# EasyEDA schematic SCH_clock1_2025-09-26.json
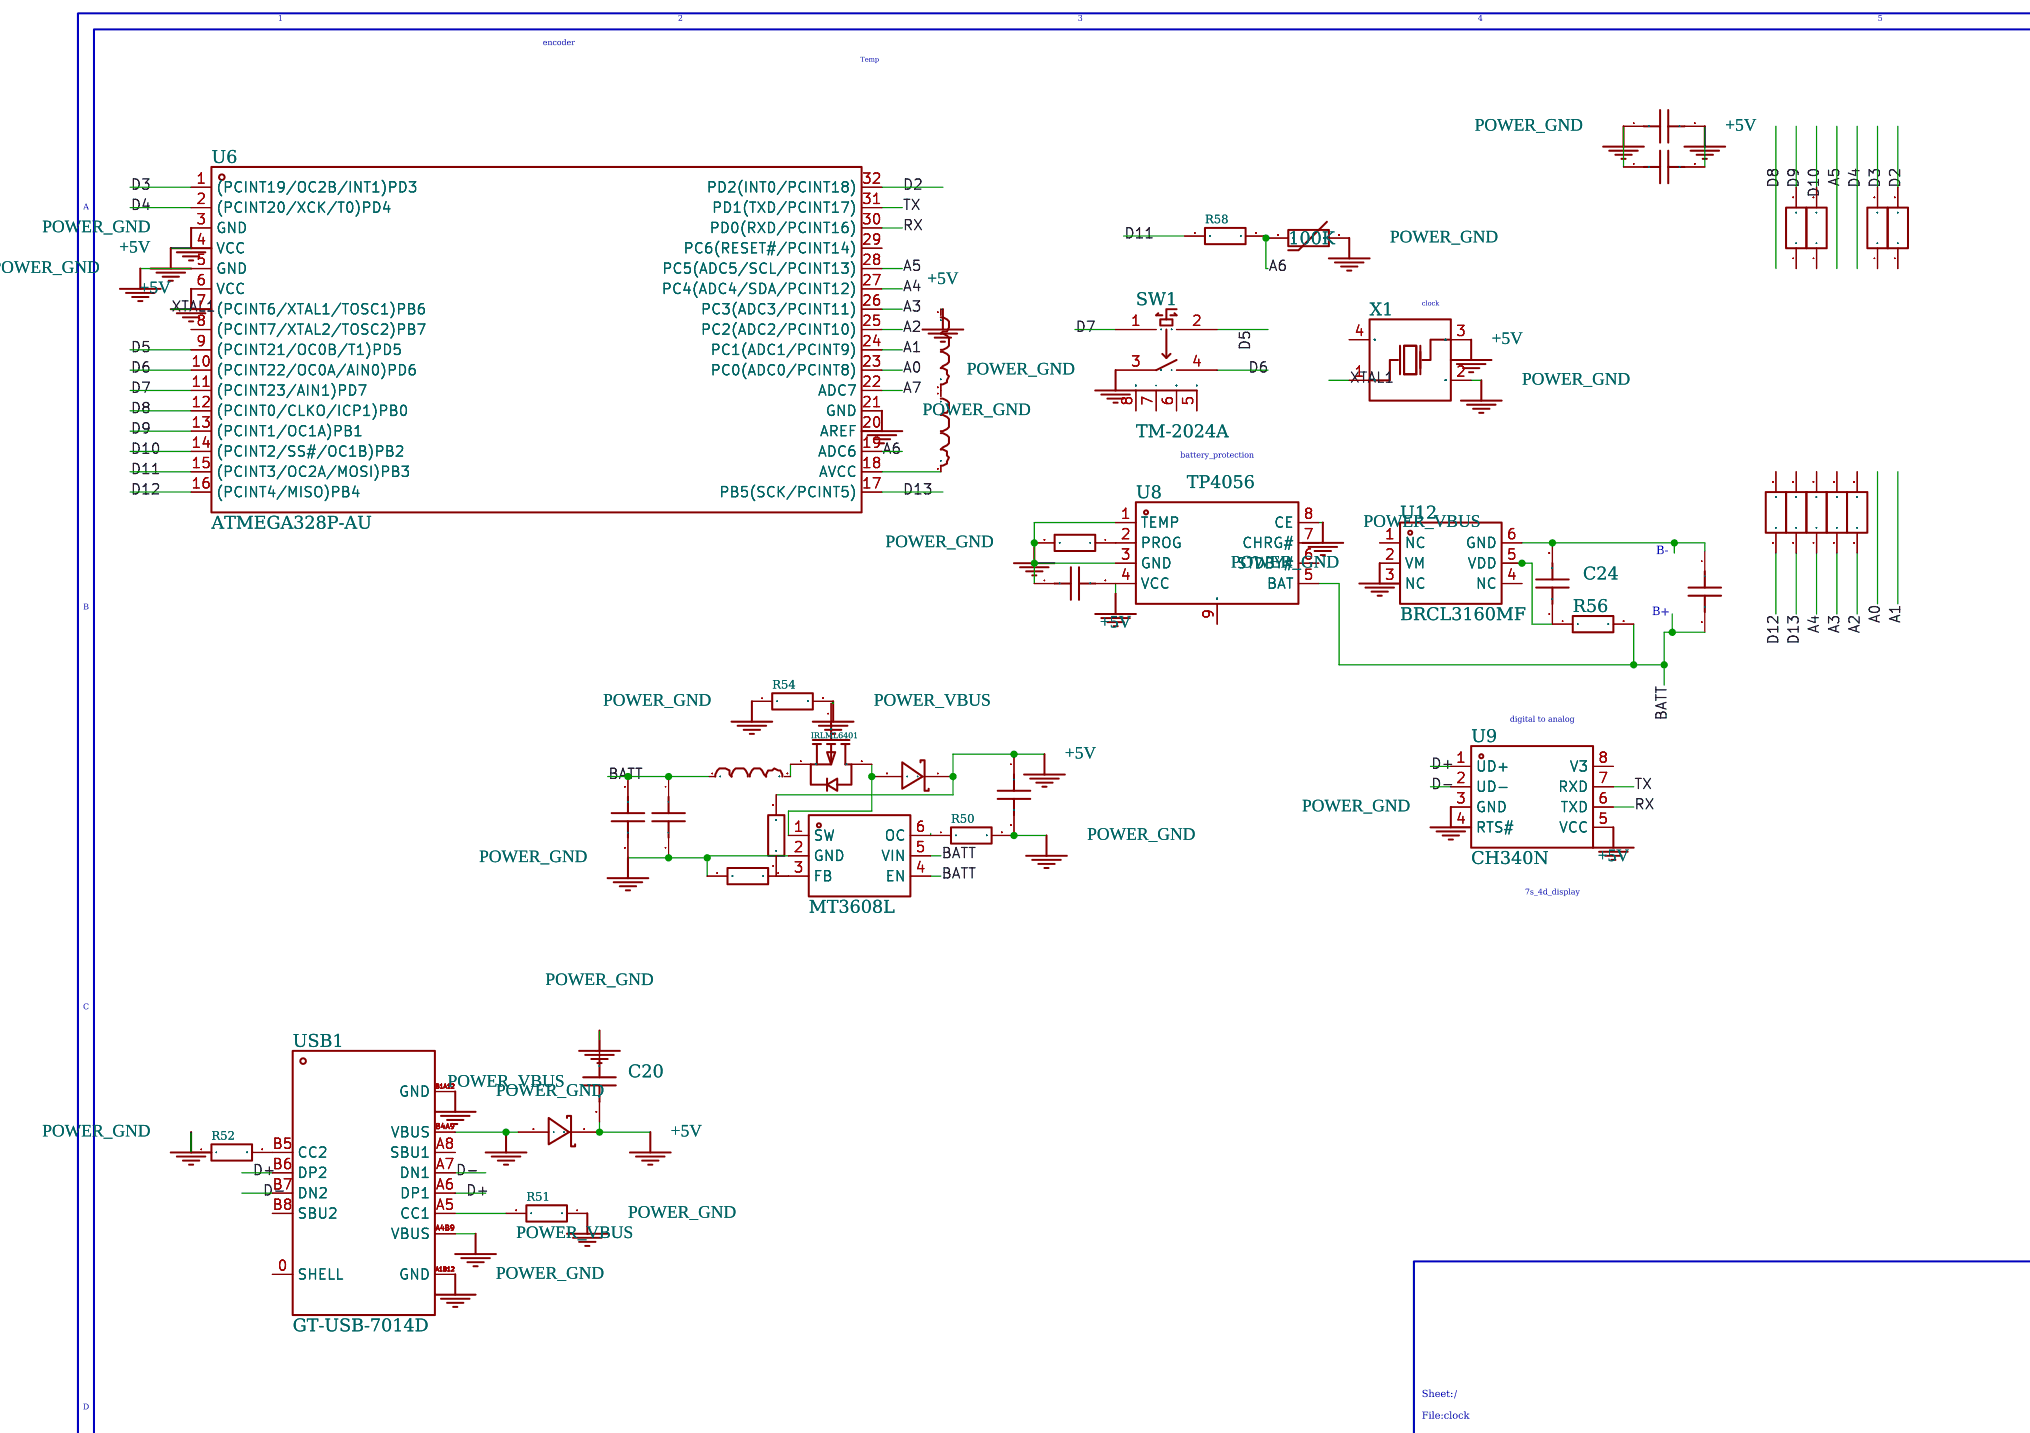
[diagram p0: schematic sheet]

## Parts
100K  NCP03WF104F05RL  [R0201]
C15  4.7uF  [C0402]
C16  4.7uF  [C0402]
C19  4.7uF  [C0402]
C20  4.7uF  [C0402]
C21  4.7uF  [C0402]
C24  100nF  [C0402]
C25  4.7uF  [C0402]
C27  4.7uF  [C0402]
C28  4.7uF  [C0402]
D5  DSK34  [SOD-123_L2.8-W1.8-LS3.7-RD]
D6  DSK34  [SOD-123_L2.8-W1.8-LS3.7-RD]
L3  4.7uH  [L1206]
L5  4.7uH  [L1206]
L6  4.7uH  [L1206]
Q1  IRLML6401  [SOT-23-3_L2.9-W1.3-P1.90-LS2.4-BR]
R39  1kΩ  [R0603]
R40  1kΩ  [R0603]
R41  1kΩ  [R0603]
R42  1kΩ  [R0603]
R43  1kΩ  [R0603]
R44  1kΩ  [R0603]
R45  1kΩ  [R0603]
R46  1kΩ  [R0603]
R48  2.4kΩ  [R0402]
R49  2.4kΩ  [R0402]
R50  100kΩ  [R0402]
R51  5.1kΩ  [R0402]
R52  5.1kΩ  [R0402]
R53  20kΩ  [R0402]
R54  5.1kΩ  [R0402]
R56  100Ω  [R0402]
R57  1kΩ  [R0603]
R58  100kΩ  [R0402]
SW1  TM-2024A  [SW-SMD_TM-2024A]
U6  ATMEGA328P-AU  [TQFP-32_L7.0-W7.0-P0.80-LS9.0-BL]
U8  TP4056  [ESOP-8_L4.9-W3.9-P1.27-LS6.0-BL-EP-1]
U9  CH340N  [SOP-8_L4.9-W3.9-P1.27-LS6.0-BL]
U10  MT3608L  [SOT-23-6_L2.9-W1.6-P0.95-LS2.8-BL_3]
U12  BRCL3160MF  [SOT-23-6_L2.9-W1.6-P0.95-LS2.8-BL]
USB1  GT-USB-7014D  [USB-C-SMD_GT-USB-7014D]
X1  16MHz  [CRYSTAL-SMD_4P-L3.2-W2.5-BL]

## Library data of the parts
100K = -: LCSC Part Name: 100kΩ 电阻精度:±1% 4250K; Supplier Part: C91635; Manufacturer: muRata(村田); Supplier Footprint: 0201; JLCPCB Part Class: Extended Part; Datasheet: https://atta.szlcsc.com/upload/public/pdf/source/20161226/1482720181078.pdf; Supplier: LCSC; Add into BOM: yes; Convert to PCB: yes; B Constant (25℃/85℃): 4311K; B Constant (25℃/100℃): 4334K; Steady State Current (Max): 100uA; Operating Temperature: -40℃+125℃
C15 C16 C19-C21 C25 C27 C28 = -: Symbol: CL05A475MQ5NRNC_C307423; Device: CL05A475MQ5NRNC_C307423; LCSC Part Name: 4.7uF ±20% 6.3V; Supplier Part: C307423; Manufacturer: SAMSUNG(三星); Manufacturer Part: CL05A475MQ5NRNC; Supplier Footprint: 0402; JLCPCB Part Class: Extended Part; Datasheet: https://item.szlcsc.com/datasheet/CL05A475MQ5NRNC/291097.html; Supplier: LCSC; Add into BOM: yes; Convert to PCB: yes; Tolerance: ±20%; Voltage Rating: 6.3V; Temperature Coefficient: X5R
C24 = -: Symbol: FCC0402B104K160AT; Device: FCC0402B104K160AT; LCSC Part Name: 100nF ±10% 16V; Supplier Part: C5137468; Manufacturer: FOJAN(富捷); Manufacturer Part: FCC0402B104K160AT; Supplier Footprint: 0402; JLCPCB Part Class: Extended Part; Datasheet: https://item.szlcsc.com/datasheet/FCC0402B104K160AT/5746970.html; Supplier: LCSC; Add into BOM: yes; Convert to PCB: yes; Tolerance: ±10%; Voltage Rating: 16V; Temperature Coefficient: X7R
D5 D6 = -: Device: DSK34_C41029; LCSC Part Name: 电压:40V 电流:3A; Supplier Part: C41029; Manufacturer: MDD(辰达半导体); Supplier Footprint: SOD-123FL; JLCPCB Part Class: Extended Part; Datasheet: https://item.szlcsc.com/datasheet/DSK34/42013.html; Supplier: LCSC; Add into BOM: yes; Convert to PCB: yes; Diode Configuration: Independent; Voltage - Forward(Vf@If): 550mV@3A; Voltage - DC Reverse(Vr): 40V; Current - Rectified: 3A; Reverse Leakage Current (Ir): 500uA@40V; Operating Junction Temperature Range: -55℃+150℃; Non-Repetitive Peak Forward Surge Current: 80A
L3 L5 L6 = -: Symbol: CMI321609U4R7KT; Device: CMI321609U4R7KT; LCSC Part Name: 4.7uH ±10%; Supplier Part: C1049; Manufacturer: FH(风华); Manufacturer Part: CMI321609U4R7KT; Supplier Footprint: 1206; JLCPCB Part Class: Extended Part; Datasheet: https://atta.szlcsc.com/upload/public/pdf/source/20230223/88BF0F64804B4350E07D929F36C73B7F.pdf; Supplier: LCSC; Add into BOM: yes; Convert to PCB: yes; Tolerance: ±10%; Q @ Freq: 35@10MHz
Q1 = -: Symbol: IRLML6401_C5190144; Device: IRLML6401_C5190144; LCSC Part Name: P沟道MOSFET,电流:-4A,耐压:-30V; Supplier Part: C5190144; Manufacturer: Hottech(合科泰); Supplier Footprint: SOT-23; JLCPCB Part Class: Extended Part; Datasheet: https://item.szlcsc.com/datasheet/IRLML6401/5870750.html; Supplier: LCSC; Add into BOM: yes; Convert to PCB: yes; Number: 1 P-Channel; Drain to Source Voltage: 30V; Current - Continuous Drain(Id): 4A; RDS(on): 52mΩ@10V,4A; Pd - Power Dissipation: 1.4W; Gate Threshold Voltage (Vgs(th)): 1.2V; Input Capacitance(Ciss): 645pF; Reverse Transfer Capacitance (Crss@Vds): 55pF; Operating Temperature: -55℃+150℃
R39-R46 R57 = -: Symbol: FRC0603F1001TS; Device: FRC0603F1001TS; LCSC Part Name: 1kΩ ±1% 100mW 厚膜电阻; Supplier Part: C2907002; Manufacturer: FOJAN(富捷); Manufacturer Part: FRC0603F1001TS; Supplier Footprint: 0603; JLCPCB Part Class: Extended Part; Supplier: LCSC; Add into BOM: yes; Convert to PCB: yes; Type: Thick Film Resistor; Tolerance: ±1%; Power(Watts): 100mW; Voltage-Supply(Max): 75V; Temperature Coefficient: ±100ppm/℃; Operating Temperature: -55℃+155℃
R48 R49 = -: Symbol: 0402WGF2401TCE; Device: 0402WGF2401TCE; LCSC Part Name: 2.4kΩ ±1% 62.5mW 厚膜电阻; Supplier Part: C25882; Manufacturer: UNI-ROYAL(厚声); Manufacturer Part: 0402WGF2401TCE; Supplier Footprint: 0402; JLCPCB Part Class: Extended Part; Datasheet: https://atta.szlcsc.com/upload/public/pdf/source/20200306/C422600_1E6D84923E4A46A82E41ADD87F860B5C.pdf; Supplier: LCSC; Add into BOM: yes; Convert to PCB: yes; Type: Thick Film Resistors; Tolerance: ±1%; Temperature Coefficient: ±100ppm/℃; Operating Temperature Range: -55℃+155℃
R50 R58 = -: Symbol: 0402WGF1003TCE; Device: 0402WGF1003TCE; Supplier: LCSC; Manufacturer: UNI-ROYAL(厚声); Manufacturer Part: 0402WGF1003TCE; Supplier Part: C25741; JLCPCB Part Class: Basic Part; LCSC Part Name: 100kΩ ±1% 62.5mW 厚膜电阻; Supplier Footprint: 0402; Datasheet: https://item.szlcsc.com/datasheet/0402WGF1003TCE/26484.html; Add into BOM: yes; Convert to PCB: yes; Type: Thick Film Resistor; Tolerance: ±1%; Power(Watts): 62.5mW; Voltage-Supply(Max): 50V; Temperature Coefficient: ±100ppm/℃; Operating Temperature: -55℃+155℃
R51 R52 R54 = -: Symbol: 0402WGF5101TCE; Device: 0402WGF5101TCE; Supplier: LCSC; Manufacturer: UNI-ROYAL(厚声); Manufacturer Part: 0402WGF5101TCE; Supplier Part: C25905; JLCPCB Part Class: Basic Part; LCSC Part Name: 5.1kΩ ±1% 62.5mW 厚膜电阻; Supplier Footprint: 0402; Datasheet: https://item.szlcsc.com/datasheet/0402WGF5101TCE/26648.html; Add into BOM: yes; Convert to PCB: yes; Type: Thick Film Resistor; Tolerance: ±1%; Power(Watts): 62.5mW; Voltage-Supply(Max): 50V; Temperature Coefficient: ±100ppm/℃; Operating Temperature: -55℃+155℃
R53 = -: Symbol: 0402WGF2002TCE; Device: 0402WGF2002TCE; Supplier: LCSC; Manufacturer: UNI-ROYAL(厚声); Manufacturer Part: 0402WGF2002TCE; Supplier Part: C25765; JLCPCB Part Class: Basic Part; LCSC Part Name: 20kΩ ±1% 62.5mW 厚膜电阻; Supplier Footprint: 0402; Datasheet: https://atta.szlcsc.com/upload/public/pdf/source/20200306/C422600_1E6D84923E4A46A82E41ADD87F860B5C.pdf; Add into BOM: yes; Convert to PCB: yes; Type: Thick Film Resistors; Tolerance: ±1%; Temperature Coefficient: ±100ppm/℃; Operating Temperature Range: -55℃+155℃
R56 = -: Symbol: 0402WGF1000TCE; Device: 0402WGF1000TCE; LCSC Part Name: 100Ω ±1% 62.5mW 厚膜电阻; Supplier Part: C25076; Manufacturer: UNI-ROYAL(厚声); Manufacturer Part: 0402WGF1000TCE; Supplier Footprint: 0402; JLCPCB Part Class: Basic Part; Datasheet: https://atta.szlcsc.com/upload/public/pdf/source/20200306/C422600_1E6D84923E4A46A82E41ADD87F860B5C.pdf; Supplier: LCSC; Add into BOM: yes; Convert to PCB: yes; Type: Thick Film Resistors; Tolerance: ±1%; Temperature Coefficient: ±200ppm/℃; Operating Temperature Range: -55℃+155℃
SW1 = -: LCSC Part Name: 四脚两档拨轮开关TM-2024A; Supplier Part: C561480; Manufacturer: XKB Connection(中国星坤); Supplier Footprint: SMD; JLCPCB Part Class: Extended Part; Datasheet: https://atta.szlcsc.com/upload/public/pdf/source/20211011/7A4DB3DC37E7D5823B6D92C66ED3191E.pdf; Supplier: LCSC; Add into BOM: yes; Convert to PCB: yes
U6 = -: Device: ATMEGA328P-AU_C14877; LCSC Part Name: 基于AVR增强型RISC架构的低功耗CMOS 8位微控制器; Supplier Part: C14877; Manufacturer: MICROCHIP(美国微芯); Supplier Footprint: TQFP-32(7x7); JLCPCB Part Class: Extended Part; Datasheet: https://item.szlcsc.com/datasheet/ATMEGA328P-AU/15549.html; Supplier: LCSC; Add into BOM: yes; Convert to PCB: yes; CPU Core: AVR; CPU Maximum Speed: 20MHz; Program Storage Size: 32KB; Program Memory Type: FLASH; EEPROM: 1KB; Number of I/O: 23; ADC (Bit): 10bit; Voltage - Supply: 1.8V5.5V
U8 = -: Symbol: TP4056_C42422118; Device: TP4056_C42422118; Supplier Part: C42422118; Manufacturer: TDSEMIC(拓电半导体); Supplier Footprint: ESOP-8; JLCPCB Part Class: Extended Part; Datasheet: https://item.szlcsc.com/datasheet/TP4056/44440371.html; Supplier: LCSC; Add into BOM: yes; Convert to PCB: yes; The Chip Type: Charging IC; Voltage - Supply: 4.5V6V; Charge Current - Max: 1A; Charging Saturation Voltage: 4.2V; Type of Battery: Lithium Battery; Number of Cells: 1; Operating Temperature: -25℃+125℃; Battery Temperature Detection: Support; Supply Current (Iq): 55uA
U9 = -: Symbol: CH340N_C2977777; LCSC Part Name: USB2.0芯片CH340; Supplier Part: C2977777; Manufacturer: WCH(南京沁恒); Supplier Footprint: SOP-8; JLCPCB Part Class: Extended Part; Datasheet: https://atta.szlcsc.com/upload/public/pdf/source/20240313/115CDE92081B1D6CB446704AD5D0F5F2.pdf; Supplier: LCSC; Add into BOM: yes; Convert to PCB: yes; Applications Function: USB to serial; Number of Channels: 1; Voltage - Supply: 3.3V；5V; Data Rate: 2Mbps; Operating Temperature: -20℃+70℃
U10 = -: LCSC Part Name: 高效2.5A 1.2MHz升压转换器; Supplier Part: C2932326; Manufacturer: 西安航天民芯; Supplier Footprint: SOT-23-6; JLCPCB Part Class: Extended Part; Datasheet: https://item.szlcsc.com/datasheet/MT3608L/3276649.html; Supplier: LCSC; Add into BOM: yes; Convert to PCB: yes; Function: Boost; Voltage - Supply: 2.2V16V; Output Current: 2.5A; Frequency - Switching: 1.2MHz; Operating Temperature: -40℃+85℃@(TA); Synchronous Rectifier: No; Number of Outputs: 1; Topology: Boost; Quiescent Current: 100uA; Switch tube (built-in/external): Built-In; Output Type: Adjustable
U12 = -: LCSC Part Name: 单节锂离子/锂聚合物可充电电池组保护解决方案; Supplier Part: C668668; Manufacturer: BLUE ROCKET(蓝箭); Supplier Footprint: SOT-23-6; JLCPCB Part Class: Extended Part; Datasheet: https://item.szlcsc.com/datasheet/BRCL3160MF/699344.html; Supplier: LCSC; Add into BOM: yes; Convert to PCB: yes; The Chip Type: Protection IC; Voltage - Supply: 2.8V6V; Charging Saturation Voltage: 4.35V; End-Off Voltage: 2.3V; Type of Battery: Lithium Battery; Number of Cells: 1; Battery Temperature Detection: Not Supported
USB1 = -: LCSC Part Name: Type-C 母 沉板; Supplier Part: C2843969; Manufacturer: G-Switch(品赞); Supplier Footprint: SMD; JLCPCB Part Class: Extended Part; Datasheet: https://item.szlcsc.com/datasheet/GT-USB-7014D/3033334.html; Supplier: LCSC; Add into BOM: yes; Convert to PCB: yes; Connector Type: Type-C; Protocol Standard: USB 2.0; Gender: Female; Mounting Type: Recessed Mount; Number of Contacts: 16P; Number of Ports: 1; Current Rating-Power: 5A; Voltage Rating: 24V; Connect-Disconnect Life: 10,000 Cycles; Center Height: 0.52mm; Length: 6.5mm; Detection color: Black; Operating Temperature: -40℃+85℃
X1 = -: Symbol: SMD-3225_4P 16MHz 20pF 10ppm -40+85℃; Device: TAXM16M4RLBCCT2T; LCSC Part Name: 16MHz ±10ppm 20pF; Supplier Part: C164049; Manufacturer: YJX(雅晶鑫); Manufacturer Part: TAXM16M4RLBCCT2T; Supplier Footprint: SMD3225-4P; JLCPCB Part Class: Extended Part; Datasheet: https://item.szlcsc.com/datasheet/TAXM16M4RLBCCT2T/175431.html; Supplier: LCSC; Add into BOM: yes; Convert to PCB: yes; Type: Crystal Oscillator; Normal temperature Frequency Tolerance: ±10ppm; Load Capacitance: 20pF; Frequency Stability: ±15ppm; Equivalent Series Resistance(ESR): 40Ω; Operating Temperature: -40℃+85℃

## Nets
+5V: C19.2 C20.2 C21.1 C25.2 C27.2 D5.1(K) D6.1(K) L6.1 R53.2 U6.4(VCC) U6.6(VCC) U8.4(VCC) U9.5(VCC) X1.3(OSC2)
A0: U6.23(PC0(ADC0/PCINT8))
A1: U6.24(PC1(ADC1/PCINT9))
A2: R42.1 U6.25(PC2(ADC2/PCINT10))
A3: R43.1 U6.26(PC3(ADC3/PCINT11))
A4: R57.1 U6.27(PC4(ADC4/SDA/PCINT12))
A5: U6.28(PC5(ADC5/SCL/PCINT13))
A6: 100K.1 R58.2 U6.19(ADC6)
A7: U6.22(ADC7)
BATT: C15.1 C16.1 C28.2 L3.1 R56.2 U8.5(BAT) U10.4(EN) U10.5(VIN)
D2: R44.2 U6.32(PD2(INT0/PCINT18))
D3: R40.2 U6.1((PCINT19/OC2B/INT1)PD3)
D4: U6.2((PCINT20/XCK/T0)PD4)
D5: SW1.2 U6.9((PCINT21/OC0B/T1)PD5)
D6: SW1.4 U6.10((PCINT22/OC0A/AIN0)PD6)
D7: SW1.1 U6.11((PCINT23/AIN1)PD7)
D8: U6.12((PCINT0/CLKO/ICP1)PB0)
D9: R39.2 U6.13((PCINT1/OC1A)PB1)
D10: R41.2 U6.14((PCINT2/SS#/OC1B)PB2)
D11: R58.1 U6.15((PCINT3/OC2A/MOSI)PB3)
D12: R46.1 U6.16((PCINT4/MISO)PB4)
D13: R45.1 U6.17(PB5(SCK/PCINT5))
D+: U9.1(UD+) USB1.A6(DP1) USB1.B6(DP2)
D-: U9.2(UD-) USB1.A7(DN1) USB1.B7(DN2)
POWER_GND: 100K.2 C15.2 C16.2 C19.1 C20.1 C21.2 C25.1 C27.1 R48.2 R49.2 R50.2 R51.1 R52.1 R54.1 SW1.3 U6.3(GND) U6.5(GND) U6.21(GND) U8.1(TEMP) U8.3(GND) U9.3(GND) U10.2(GND) U12.2(VM) USB1.A1B12(GND) USB1.B1A12(GND) X1.2(GND)
POWER_VBUS: D6.2(A) Q1.1(G) R54.2 U8.8(CE) USB1.A4B9(VBUS) USB1.B4A9(VBUS)
RX: U6.30(PD0(RXD/PCINT16)) U9.6(TXD)
TX: U6.31(PD1(TXD/PCINT17)) U9.7(RXD)
XTAL1: U6.7((PCINT6/XTAL1/TOSC1)PB6) X1.1(OSC1)
Net-(C24-1): C24.1 R56.1 U12.5(VDD)
Net-(C24-2): C24.2 C28.1 U12.6(GND)
Net-(D5-2): D5.2(A) Q1.3(D) U10.1(SW)
Net-(L3-2): L3.2 Q1.2(S)
Net-(L5-1): L5.1 L6.2
Net-(L5-2): L5.2 U6.18(AVCC)
Net-(R48-1): R48.1 U8.2(PROG)
Net-(R49-1): R49.1 R53.1 U10.3(FB)
Net-(R50-1): R50.1 U10.6(OC)
Net-(R51-2): R51.2 USB1.A5(CC1)
Net-(R52-2): R52.2 USB1.B5(CC2)

Not connected (* = marked no-connect by the designer): R39 1; R40 1; R41 1; R42 2; R43 2; R44 1; R45 2; R46 2; R57 2; SW1 5 6 7 8; U6 8((PCINT7/XTAL2/TOSC2)PB7) 20(AREF) 29(PC6(RESET#/PCINT14)); U8 6(STDBY#) 7(CHRG#) 9(GND); U9 4(RTS#) 8(V3); U12 1(NC) 3(NC) 4(NC); USB1 0(SHELL) A8(SBU1) B8(SBU2); X1 4(GND)

## Notes on the sheet
- 1
- 2
- 3
- 4
- 5
- 6
- encoder
- Temp
- A
- A
- clock
- battery_protection
- B-
- B
- B+
- B
- digital to analog
- 7s_4d_display
- C
- C
- D
- Sheet:/
- D
- File:clock
- Title:
- Size:"A4"
- Date:
- Rev:
- Id:/
- 1
- 2
- 3
- 4
- 5
- 6
